# EAGLE design irs-v3 (EAGLE 7.6.0)
CNAME: IRS sensor (RFM69HW); CREVISION: 1; DESIGNER: Dariusz Mazur
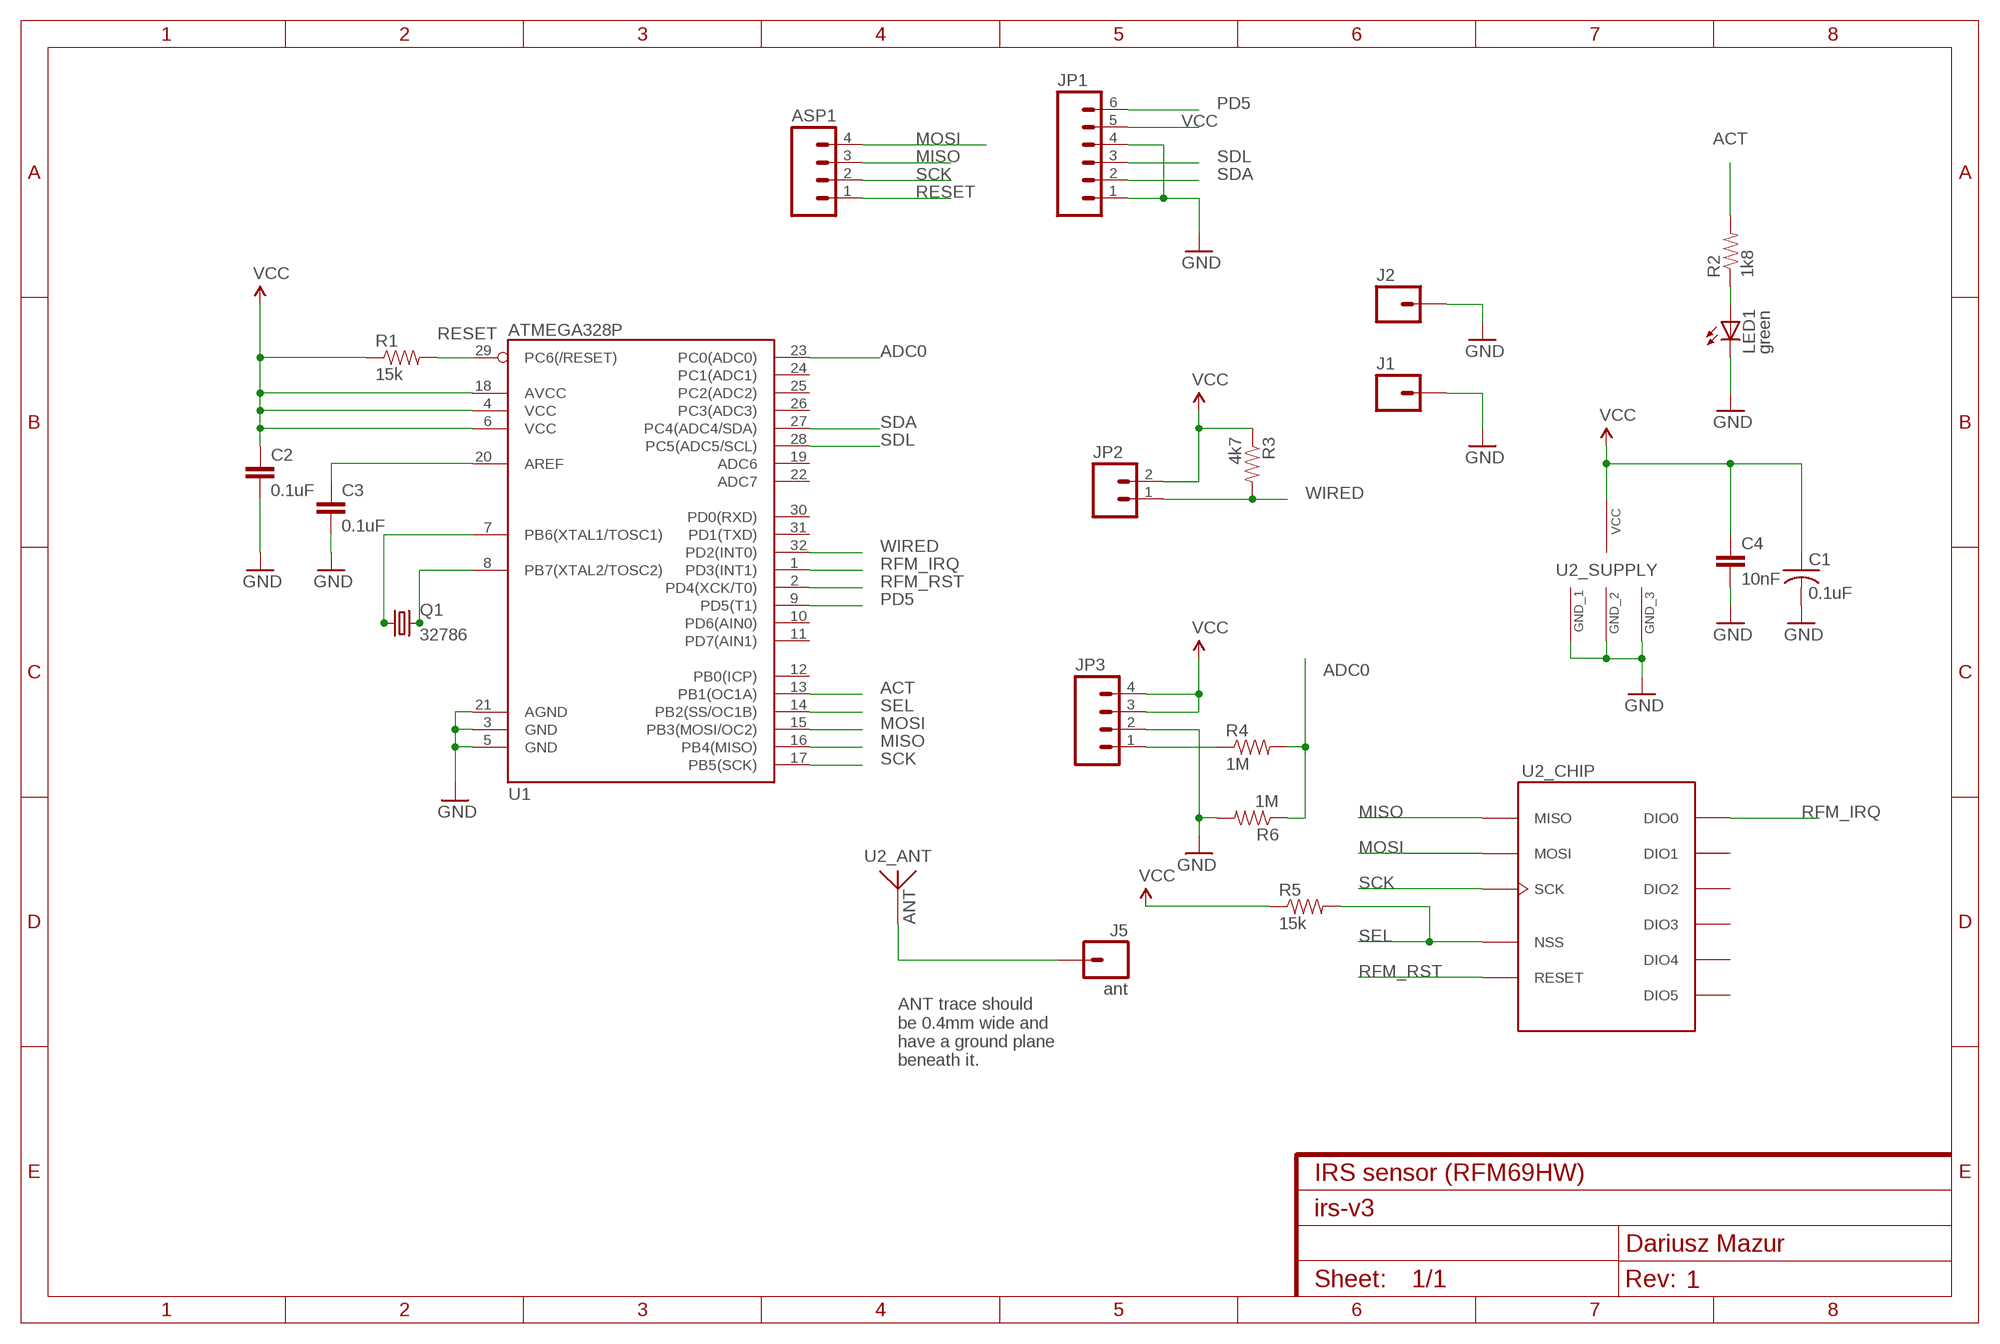
[diagram p0: schematic, sheet 1]

## Parts
ASP1  M04NO_SILK_ALL_ROUND  [1X04_NO_SILK_ALL_ROUND]
C1  0.1uF  C-USC0603  [C0603]
C2  0.1uF  0.1UF-25V(+80/-20%)(0603)  [0603-CAP]
C3  0.1uF  0.1UF-25V(+80/-20%)(0603)  [0603-CAP]
C4  10nF  CAP0603-CAP  [0603-CAP]
J1  M01PTH_NO_SILK_YES_STOP  [1X01_NO_SILK]
J2  M01PTH_NO_SILK_YES_STOP  [1X01_NO_SILK]
J5  ant  M01PTH_LONGPAD  [1X01_LONGPAD]
JP1  M06NO_SILK_FEMALE_PTH  [1X06_NO_SILK]
JP2  M021X02_NO_SILK  [1X02_NO_SILK]
JP3  M04NO_SILK_ALL_ROUND  [1X04_NO_SILK_ALL_ROUND]
LED1  green  LED0603  [LED-0603]
Q1  32786  MC-306  [MC-306]
R1  15k  RESISTOR0603-RES  [0603-RES]
R2  1k8  RESISTOR0603-RES  [0603-RES]
R3  4k7  RESISTOR0603-RES  [0603-RES]
R4  1M  RESISTOR0603-RES  [0603-RES]
R5  15k  RESISTOR0603-RES  [0603-RES]
R6  1M  RESISTOR0603-RES  [0603-RES]
U1  ATMEGA328P  ATMEGA328_SMT  [TQFP32-08]
U2  RFM69HCW-S2  [HOPE-RF-16]

## Nets
ACT: R2.2 U1.13(PB1(OC1A))
ADC0: R4.2 R6.1 U1.23(PC0(ADC0))
GND: C1.2 C2.2 C3.2 C4.2 J1.1 J2.1 JP1.1 JP1.4 JP3.2 LED1.C R6.2 U1.3(GND) U1.5(GND) U1.21(AGND) U2.GND1(_SUPPLY:GND_1) U2.GND2(_SUPPLY:GND_2) U2.GND3(_SUPPLY:GND_3)
MISO: ASP1.3 U1.16(PB4(MISO)) U2.MISO(_CHIP:MISO)
MOSI: ASP1.4 U1.15(PB3(MOSI/OC2)) U2.MOSI(_CHIP:MOSI)
N$1: LED1.A R2.1
N$2: JP3.1 R4.1
N$3: J5.1 U2.ANT(_ANT:ANT)
N$4: C3.1 U1.20(AREF)
N$5: Q1.1 U1.7(PB6(XTAL1/TOSC1))
N$6: Q1.4 U1.8(PB7(XTAL2/TOSC2))
PD5: JP1.6 U1.9(PD5(T1))
RESET: ASP1.1 R1.2 U1.29(PC6(/RESET))
RFM_IRQ: U1.1(PD3(INT1)) U2.DIO0(_CHIP:DIO0)
RFM_RST: U1.2(PD4(XCK/T0)) U2.RESET(_CHIP:RESET)
SCK: ASP1.2 U1.17(PB5(SCK)) U2.SCK(_CHIP:SCK)
SDA: JP1.2 U1.27(PC4(ADC4/SDA))
SDL: JP1.3 U1.28(PC5(ADC5/SCL))
SEL: R5.2 U1.14(PB2(SS/OC1B)) U2.NSS(_CHIP:NSS)
VCC: C1.1 C2.1 C4.1 JP1.5 JP2.2 JP3.3 JP3.4 R1.1 R3.1 R5.1 U1.4(VCC) U1.6(VCC) U1.18(AVCC) U2.3.3V(_SUPPLY:VCC)
WIRED: JP2.1 R3.2 U1.32(PD2(INT0))
Unconnected: U1.10(PD6(AIN0)) U1.11(PD7(AIN1)) U1.12(PB0(ICP)) U1.19(ADC6) U1.22(ADC7) U1.24(PC1(ADC1)) U1.25(PC2(ADC2)) U1.26(PC3(ADC3)) U1.30(PD0(RXD)) U1.31(PD1(TXD)) U2.DIO1(_CHIP:DIO1) U2.DIO2(_CHIP:DIO2) U2.DIO3(_CHIP:DIO3) U2.DIO4(_CHIP:DIO4) U2.DIO5(_CHIP:DIO5)

## Notes on the sheet
- ANT trace should
  be 0.4mm wide and
  have a ground plane
  beneath it.

## Library data of the parts
ASP1 JP3 = SparkFun-Connectors:M04: Header 4 Standard 4-pin 0.1" header. Use with straight break away headers (SKU : PRT-00116), right angle break away headers (PRT-00553), swiss pins (PRT-00743), machine pins (PRT-00117), and female headers (PRT-00115). Molex polarized connector foot print use with SKU : PRT-08231 with associated crimp pins and housings. 1MM SMD Version SKU: PRT-10208; PROD_ID: CONN-09696
C1 = adafruit:C-US: CAPACITOR, American symbol
C2 C3 = SparkFun-Capacitors:0.1UF-25V(+80/-20%)(0603): CAP-00810 Ceramic Standard decoupling cap; PROD_ID: CAP-00810
C4 = SparkFun-Capacitors:CAP: Capacitor Standard 0603 ceramic capacitor, and 0.1" leaded capacitor.
J1 J2 J5 = SparkFun-Connectors:M01: Header 1 Standard 1-pin 0.1" header. Use with straight break away headers (SKU : PRT-00116), right angle break away headers (PRT-00553), swiss pins (PRT-00743), machine pins (PRT-00117), and female headers (PRT-00115). SMTSO-256-ET is a "flush mount" nut for a 4-40 screw. The older package used to be too tight, and did not allow it to sit properly thru the drill hit. The latest (0.165DIA) fits nice and snug.
JP1 = SparkFun-Connectors:M06: Header 6 Standard 6-pin 0.1" header. Use with straight break away headers (SKU : PRT-00116), right angle break away headers (PRT-00553), swiss pins (PRT-00743), machine pins (PRT-00117), and female headers (PRT-00115). Molex polarized connector foot print use with SKU : PRT-08094 with associated crimp pins and housings. NOTES ON THE VARIANTS LOCK and LOCK_LONGPADS... This footprint was designed to help hold the alignment of a through-hole component (i.e. 6-pin header) while soldering it into place. You may notice that each hole has been shifted either up or down by 0.005 of an inch from it's more standard position (which is a perfectly straight line). This slight alteration caused the pins (the squares in the middle) to touch the edges of the holes. Because they are alternating, it causes a "brace" to hold the component in place. 0.005 has proven to be the perfect amount of "off-center" position when using our standard breakaway headers. Although looks a little odd when you look at the bare footprint, once you have a header in there, the alteration is very hard to notice. Also,if you push a header all the way into place, it is covered up entirely on the bottom side. This idea of altering the position of holes to aid alignment will be further integrated into the Sparkfun Library for other footprints. It can help hold any component with 3 or more connection pins.; PROD_ID: CONN-08437
JP2 = SparkFun-Connectors:M02: Standard 2-pin 0.1" header. Use with - straight break away headers ( PRT-00116) - right angle break away headers (PRT-00553) - swiss pins (PRT-00743) - machine pins (PRT-00117) - female headers (PRT-00115) Molex polarized connector foot print use with: PRT-08233 with associated crimp pins and housings. 2.54_SCREWTERM for use with PRT-10571. 3.5mm Screw Terminal footprints for PRT-08084 5mm Screw Terminal footprints for use with PRT-08432
LED1 = SparkFun-LED:LED: LEDs Standard schematic elements and footprints for 5mm, 3mm, 1206, and 0603 sized LEDs. 5mm - Spark Fun Electronics SKU : COM-00529 (and others)
Q1 = crystal:MC-306: kHz RANGE CRYSTAL UNIT SMD Source: MC-306_405_406_E07X.PDF Homepage <http://www.epsontoyocom.co.jp>; MPN: MC-306 60.0KHZ 100PPM ,12.5PF; OC_FARNELL: 1278040; OC_NEWARK: 31M5576
R1-R6 = SparkFun-Passives:RESISTOR: Resistor Basic schematic elements and footprints for 0603, 1206, and PTH resistors.
U1 = SparkFun-DigitalIC:ATMEGA328_SMT: 32-Pin Atmega328 part Commonly used on Arduino compatible boards Available in QFP and QFN packages TQFP is IC-09069 QFN is non-stock; PROD_ID: IC-09069
U2 = icmi-custom-parts:RFM69HCW: HopeRF RFM69HCW ISM Transceiver Module The RFM69HCW <http://www.hoperf.com/rf/fsk_module/RFM69HCW.htm> is a transceiver module capable of operation over a wide frequency range, including the 315,433,868 and 915MHz license-free ISM (Industry Scientific and Medical) frequency bands. All major RF communication parameters are programmable and most of them can be dynamically set. The RFM69HCW offers the unique advantage of programmable narrow-band and wide- band communication modes. The RFM69HCW is optimized for low power consumption while offering high RF output power and channelized operation. Compliance ETSI and FCC regulations. In order to better use RFM69HCW modules, this specification also involves a large number of the parameters and functions of its core chip RF69H's,including those IC pins which are not leaded out. All of these can help customers gain a better understanding of the performance of RFM69HCW modules, and enhance the application skills.

## Board
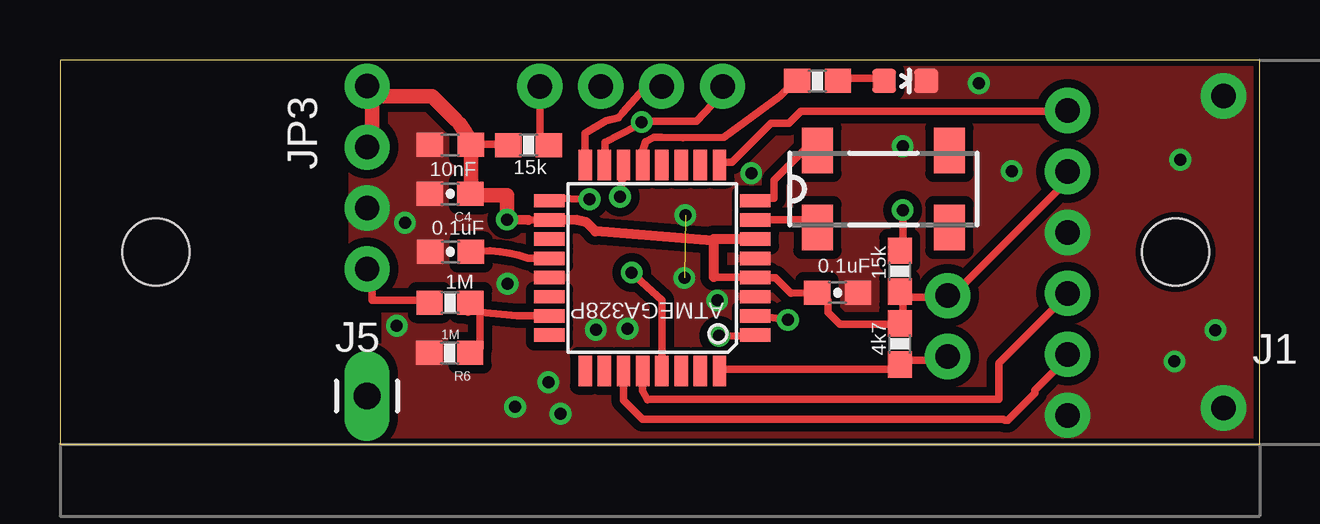
[diagram p1: board, top side]
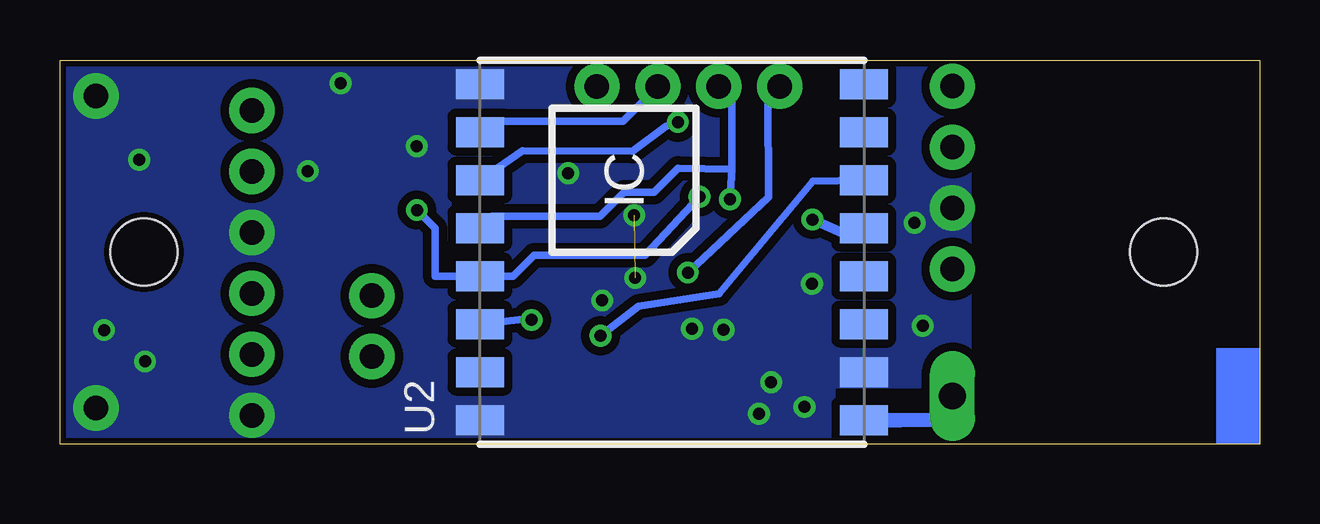
[diagram p2: board, bottom side, seen from below]

Size 50 x 16 mm. Coordinates in mm from the lower left corner, seen from the top.
Outline: 0,0 50,0 50,16 0,16 0,0
Copper layers (1*16): Top 0.035mm / dielectric 1.5mm / Bottom 0.035mm
Design rules "dirt_cheap_dirty_boards.v1 *": minimum track width 12mil, minimum drill 15mil, track to track 14mil, track to pad 14mil, pad to pad 12mil, via to via 12mil, smd to smd 0mil, copper to edge 10mil, drill to drill 12mil, minimum pad ring 12mil, minimum via ring 8mil, stop-mask expansion 2mil, vias tented up to drill 25mil, thermal gap 10mil
Holes 2.8 mm at 46.5,8 4,8
tRestrict: area 0,0 to 12,16; area 12,4.2 to 13.4,5.5
bRestrict: area 31.5,3.8 to 33.5,4.2; area 31.5,7.8 to 34,8.1; area 31.5,5.8 to 33.5,6.2; area 0,0 to 12,16; area 15.5,9.7 to 17.6,10.2; area 15.5,13.8 to 17.6,14.2; area 15.5,11.8 to 17.6,12.1; area 14,1.9 to 17.6,2.3; area 31.5,9.8 to 33.7,10.2

### Footprints (pad centres in the part's own frame; a part is rotated, then mirrored left to right if it is on the bottom)
1X04_NO_SILK_ALL_ROUND = drill 1.016 pad 1.88: 1 0,0; 2 2.54,0; 3 5.08,0; 4 7.62,0
C0603 = smd 1.1 x 1: 1 -0.85,0; 2 0.85,0
0603-CAP = smd 1.1 x 1: 1 -0.85,0; 2 0.85,0
1X01_NO_SILK = drill 1.016 pad 1.88: 1 0,0
1X01_LONGPAD = drill 1.118 pad 1.88 long: 1 0,0
1X06_NO_SILK = drill 1.016 pad 1.88: 1 0,0; 2 2.54,0; 3 5.08,0; 4 7.62,0; 5 10.16,0; 6 12.7,0
1X02_NO_SILK = drill 1.016 pad 1.88: 1 0,0; 2 2.54,0
LED-0603 = smd 1 x 1: A 0,-0.877; C 0,0.877
MC-306 = smd 1.3 x 1.9: 1 -2.75,-1.6; 2 2.75,-1.6; 3 2.75,1.6; 4 -2.75,1.6
0603-RES = smd 1.1 x 1: 1 -0.85,0; 2 0.85,0
TQFP32-08 = smd 1.27 x 0.559: 1 -4.293,2.8; 2 -4.293,2; 3 -4.293,1.2; 4 -4.293,0.4; 5 -4.293,-0.4; 6 -4.293,-1.2; 7 -4.293,-2; 8 -4.293,-2.8; 17 4.293,-2.8; 18 4.293,-2; 19 4.293,-1.2; 20 4.293,-0.4; 21 4.293,0.4; 22 4.293,1.2; 23 4.293,2; 24 4.293,2.8 | smd 0.559 x 1.27: 9 -2.8,-4.293; 10 -2,-4.293; 11 -1.2,-4.293; 12 -0.4,-4.293; 13 0.4,-4.293; 14 1.2,-4.293; 15 2,-4.293; 16 2.8,-4.293; 25 2.8,4.293; 26 2,4.293; 27 1.2,4.293; 28 0.4,4.293; 29 -0.4,4.293; 30 -1.2,4.293; 31 -2,4.293; 32 -2.8,4.293
HOPE-RF-16 = smd 1.25 x 2: 3.3V 1,-8; ANT -7,-8; DIO0 3,-8; DIO1 5,-8; DIO2 7,-8; DIO3 -3,-8; DIO4 -1,-8; DIO5 -5,8; GND1 7,8; GND2 -7,8; GND3 -5,-8; MISO 5,8; MOSI 3,8; NSS -1,8; RESET -3,8; SCK 1,8

### Placement (x,y rotation side)
ASP1  20,14.9 0 top
C1  16.27,12.47 180 top
C2  32.41,6.31 0 top
C3  16.28,8 180 top
C4  16.26,10.43 180 top
J1  48.5,1.5 0 top
J2  48.5,14.5 90 top
J5  12.8,2 0 top
JP1  42,1.19 90 top
JP2  37,3.64 90 top
JP3  12.8,7.29 90 top
LED1  35.23,15.13 270 top
Q1  34.33,10.62 0 top
R1  19.53,12.46 0 top
R2  31.58,15.13 180 top
R3  35,4.17 270 top
R4  16.26,5.89 0 top
R5  35,7.2 90 top
R6  16.24,3.8 180 top
U1  24.69,7.34 180 top
U2  24.5,8 90 bottom

### Tracks (layer width: path | path; a pad name or v marks a point on that pad's centre or on a via)
ACT
  Top 0.305: R2.2 30.5,15 30,14.5 27.68,12.78 25.97,12.77 25.06,12.79 24.75,12.79 24.4,12.6 24.29,12.24 U1.13
ADC0
  Top 0.305: 20.25,5.35 U1.23 19.06,5.34 17.5,5.5 | 17,3.5 R6.1 17.5,4 17.5,5.5 | 17,5.5 R4.2 17.5,5.5
GND  (via drill 0.5 pad 0.25)  (1 unrouted)
  Top 0.305: U1.21
  other vias: 23.66,4.8 14.04,4.92 18.66,6.68 20.36,2.58 18.97,1.54 48.17,4.75 46.46,3.44 39.67,11.37 38.31,15.03 46.7,11.84 26.02,6.92 35.13,12.41 27.4,5.98 14.38,9.22 22.34,4.76 20.86,1.26 26.07,9.53 28.82,11.28
  pour Bottom (rank 6, no thermals): 0,16 50,16 50,0 0,0
  pour Top (rank 6, no thermals): 0,16 50,16 50,0 0,0
MISO
  Top 0.305: U1.16 21.88,11.96 21.88,12.96 22.75,13.47 23.28,13.6 23.45,13.8 24.31,14.76 25,14.75 ASP1.3
  Bottom 0.305: U2.MISO 32.01,13.45 26.54,13.44 25.25,14.75 ASP1.3
MOSI  (via drill 0.5)
  Top 0.305: ASP1.4 27.5,14.5 26.52,13.45 24.27,13.45 v24.25,13.41 24,13.25 22.72,12.57 U1.15
  Bottom 0.305: U2.MOSI 30.72,12.22 26.14,12.19 24.75,13.25 v24.25,13.41
N$1
  Top 0.305: LED1.A 34.25,15.25 32.5,15.25 R2.1
N$2
  Top 0.305: R4.1 15,6 13,6 13,7 JP3.1
N$3
  Bottom 0.305: 13,2 J5.1
  Bottom 0.406: 13,2 13.41,1
  Bottom 0.61: U2.ANT 15,1 13.41,1
N$4
  Top 0.305: U1.20 19.52,7.74 arc27 C3.1
N$5
  Top 0.305: U1.7 31.34,9.34 Q1.1
N$6
  Top 0.305: U1.8 29,10.25 29.75,10.25 29.75,11 31,12.25 31.5,12.25 Q1.4
PD5
  Top 0.305: 42,14 JP1.6 41.88,13.88 30.88,13.88 30.38,13.38 29.62,13.38 28,11.75 27.5,11.75 U1.9
RESET  (via drill 0.5)
  Top 0.305: v23.83,7.14 25.1,5.99 25.1,3.54 U1.29 | ASP1.1 20,12.5 R1.2
  Bottom 0.305: v23.83,7.14 20.47,10.29 20.5,14.5 20,14.5 ASP1.1
RFM_IRQ  (via drill 0.5)
  Top 0.305: v27.46,4.51 28.5,4.5 U1.1
  Bottom 0.305: v27.46,4.51 25.88,5.74 22.52,6.25 18.61,10.95 U2.DIO0
RFM_RST  (via drill 0.5)
  Top 0.305: v30.34,5.17 29.08,5.34 U1.2
  Bottom 0.305: v30.34,5.17 30.69,5.2 U2.RESET
SCK  (via drill 0.5)
  Top 0.305: v22.07,10.2 20.5,10.25 U1.17
  Bottom 0.305: 21.98,11.45 21.98,14.7 22.5,14.75 ASP1.2 | 21.98,11.45 v22.07,10.2 | U2.SCK 32,9.5 27.5,9.5 26.5,10.5 25.25,10.5 24.25,11.5 21.98,11.45
SDA
  Top 0.305: U1.27 23.49,1.82 24.29,1.02 39.33,1.02 39.38,1 39.5,1 40.62,2.12 40.62,2.25 42,3.62 JP1.2
SDL
  Top 0.305: U1.28 24.28,2.97 24.28,2.22 24.48,1.85 24.62,1.88 39.12,1.88 39.12,3.38 42,6.25 JP1.3
SEL  (via drill 0.5)
  Top 0.305: v23.34,10.3 23.5,11.5 U1.14 | v35.12,9.75 35.12,8.5 R5.2
  Bottom 0.305: v35.12,9.75 34.38,9 34.38,7 U2.NSS 31.12,7 30.25,7.88 25.62,7.88 v23.34,10.3
VCC  (via drill 0.5 pad 0.61)
  Top 0.305: 27.25,6.95 28.75,6.95 U1.4 29.83,6.93 30.47,6.29 31.55,6.29 C2.1 32,6 32,5.5 32.5,5 35,5 R3.1 | 27.24,8.53 27.24,8.5 27.25,8.5 | 20.52,9.33 U1.18 19.52,9.33 | 18.5,12.25 R1.1 | 35.25,5.38 R3.1 | 35.12,5.38 R3.1 | R3.1 35.12,5.5 35.12,6.12 35,6.25 R5.1 35.25,6.12 37,6.12 JP2.2 37,6 42,11 JP1.5 | 18.5,12.5 R1.1 | 13,12.5 JP3.3 | 13,14.5 JP3.4 | 17.12,10.5 C4.1 17.25,10.38 | 17.12,12.38 C1.1 | R1.1 18.38,12.5 17.25,12.5 C1.1 | 17.12,12.62 C1.1 | 16.66,13.34 16.5,13.5 | 18.62,9.5 v18.63,9.35 | 27.25,8.5 27.25,8.54 | 27.25,8.5 27.2,8.47
  Top 0.406: 27.24,8.5 27.24,7.63 27.25,6.95 | 20.52,9.33 21.55,9.34 21.93,9.25 22.31,8.86 27.2,8.47 | 19.52,9.33 v18.63,9.35 | U1.6 27.25,8.54
  Top 0.61: 16.5,13.5 15.5,14.5 13,14.5 13,12.5 | 17.12,12.38 17.12,10.5 | 16.66,13.34 17.12,12.62 | 17.25,10.38 18.62,10.38 18.62,9.5
  Bottom 0.305: 17.32,8.89 U2.3.3V | 17.32,8.76 U2.3.3V | 16.37,9.21 U2.3.3V
  Bottom 0.406: 17.32,8.76 v18.63,9.35
WIRED
  Top 0.305: 35.12,3.12 35,3.12 | 35,3.12 27.5,3.12 U1.32 | 35.12,3.5 R3.2 | R3.2 35,3.12 | JP2.1 37,3.5 35.25,3.5 R3.2
(copper drawn outside any net)
  shapes: Bottom area x1

### Text on the board
Document: RESET | VCC | SCK | MISO | MOSI | GND | PD2 | VCC | AC0 | AC5 | AC4 | ANT